# Altium project Mother Board.PrjPcb
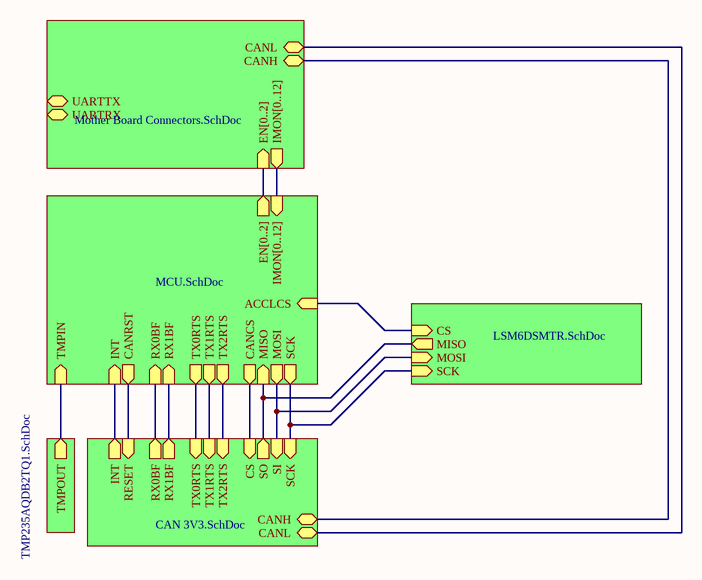
[diagram p0: Mother Board.SchDoc]
3 sheets, 20 parts. Net scope: hierarchical (ports join the sheet entries above them; power ports are global).
Board file: Mother Board.PcbDoc
Sheets:
  Mother Board.SchDoc
    Designator = Mother Board Connectors.SchDoc
    Designator = MCU.SchDoc

## Sheet Mother Board.SchDoc
size A

### Sub-sheets
Designator = Mother Board Connectors.SchDoc: EN[0..2] (in), IMON[0..12] (out), CANH (bidir), CANL (bidir), UARTTX (bidir), UARTRX (bidir)
Designator = CAN 3V3.SchDoc (file not in this document): SI (in), SO (out), CANH (bidir), TX1RTS (in), RX0BF (out), INT (out), TX2RTS (in), CS (in), SCK (in), RESET (in), TX0RTS (in), CANL (bidir), RX1BF (out)
Designator = TMP235AQDB2TQ1.SchDoc (file not in this document): TMPOUT (out)
Designator = MCU.SchDoc: EN[0..2] (out), IMON[0..12] (in), MISO (in), INT (in), RX0BF (in), RX1BF (in), MOSI (out), TX2RTS (out), TX1RTS (out), TX0RTS (out), TMPIN (in), CANCS (out), SCK (out), CANRST (out), ACCLCS (in)
Designator = LSM6DSMTR.SchDoc (file not in this document): CS (in), MOSI (in), MISO (out), SCK (in)

### Nets
20: sheet Designator/CANL, sheet Designator/CANL
21: sheet Designator/CANH, sheet Designator/CANH
NetU7_1: sheet Designator/RX0BF, sheet Designator/RX0BF
NetU7_2: sheet Designator/INT, sheet Designator/INT
NetU7_3: sheet Designator/RESET, sheet Designator/CANRST
NetU7_5: sheet Designator/SI, sheet Designator/MOSI, sheet Designator/MOSI
NetU7_8: sheet Designator/CS, sheet Designator/CANCS
NetU7_9: sheet Designator/SCK, sheet Designator/SCK, sheet Designator/SCK
NetU7_10: sheet Designator/SO, sheet Designator/MISO, sheet Designator/MISO
NetU7_17: sheet Designator/TMPOUT, sheet Designator/TMPIN
NetU7_36: sheet Designator/TX0RTS, sheet Designator/TX0RTS
NetU7_37: sheet Designator/TX1RTS, sheet Designator/TX1RTS
NetU7_38: sheet Designator/TX2RTS, sheet Designator/TX2RTS
NetU7_39: sheet Designator/ACCLCS, sheet Designator/CS
NetU7_40: sheet Designator/RX1BF, sheet Designator/RX1BF

## Sheet Mother Board Connectors.SchDoc
size B
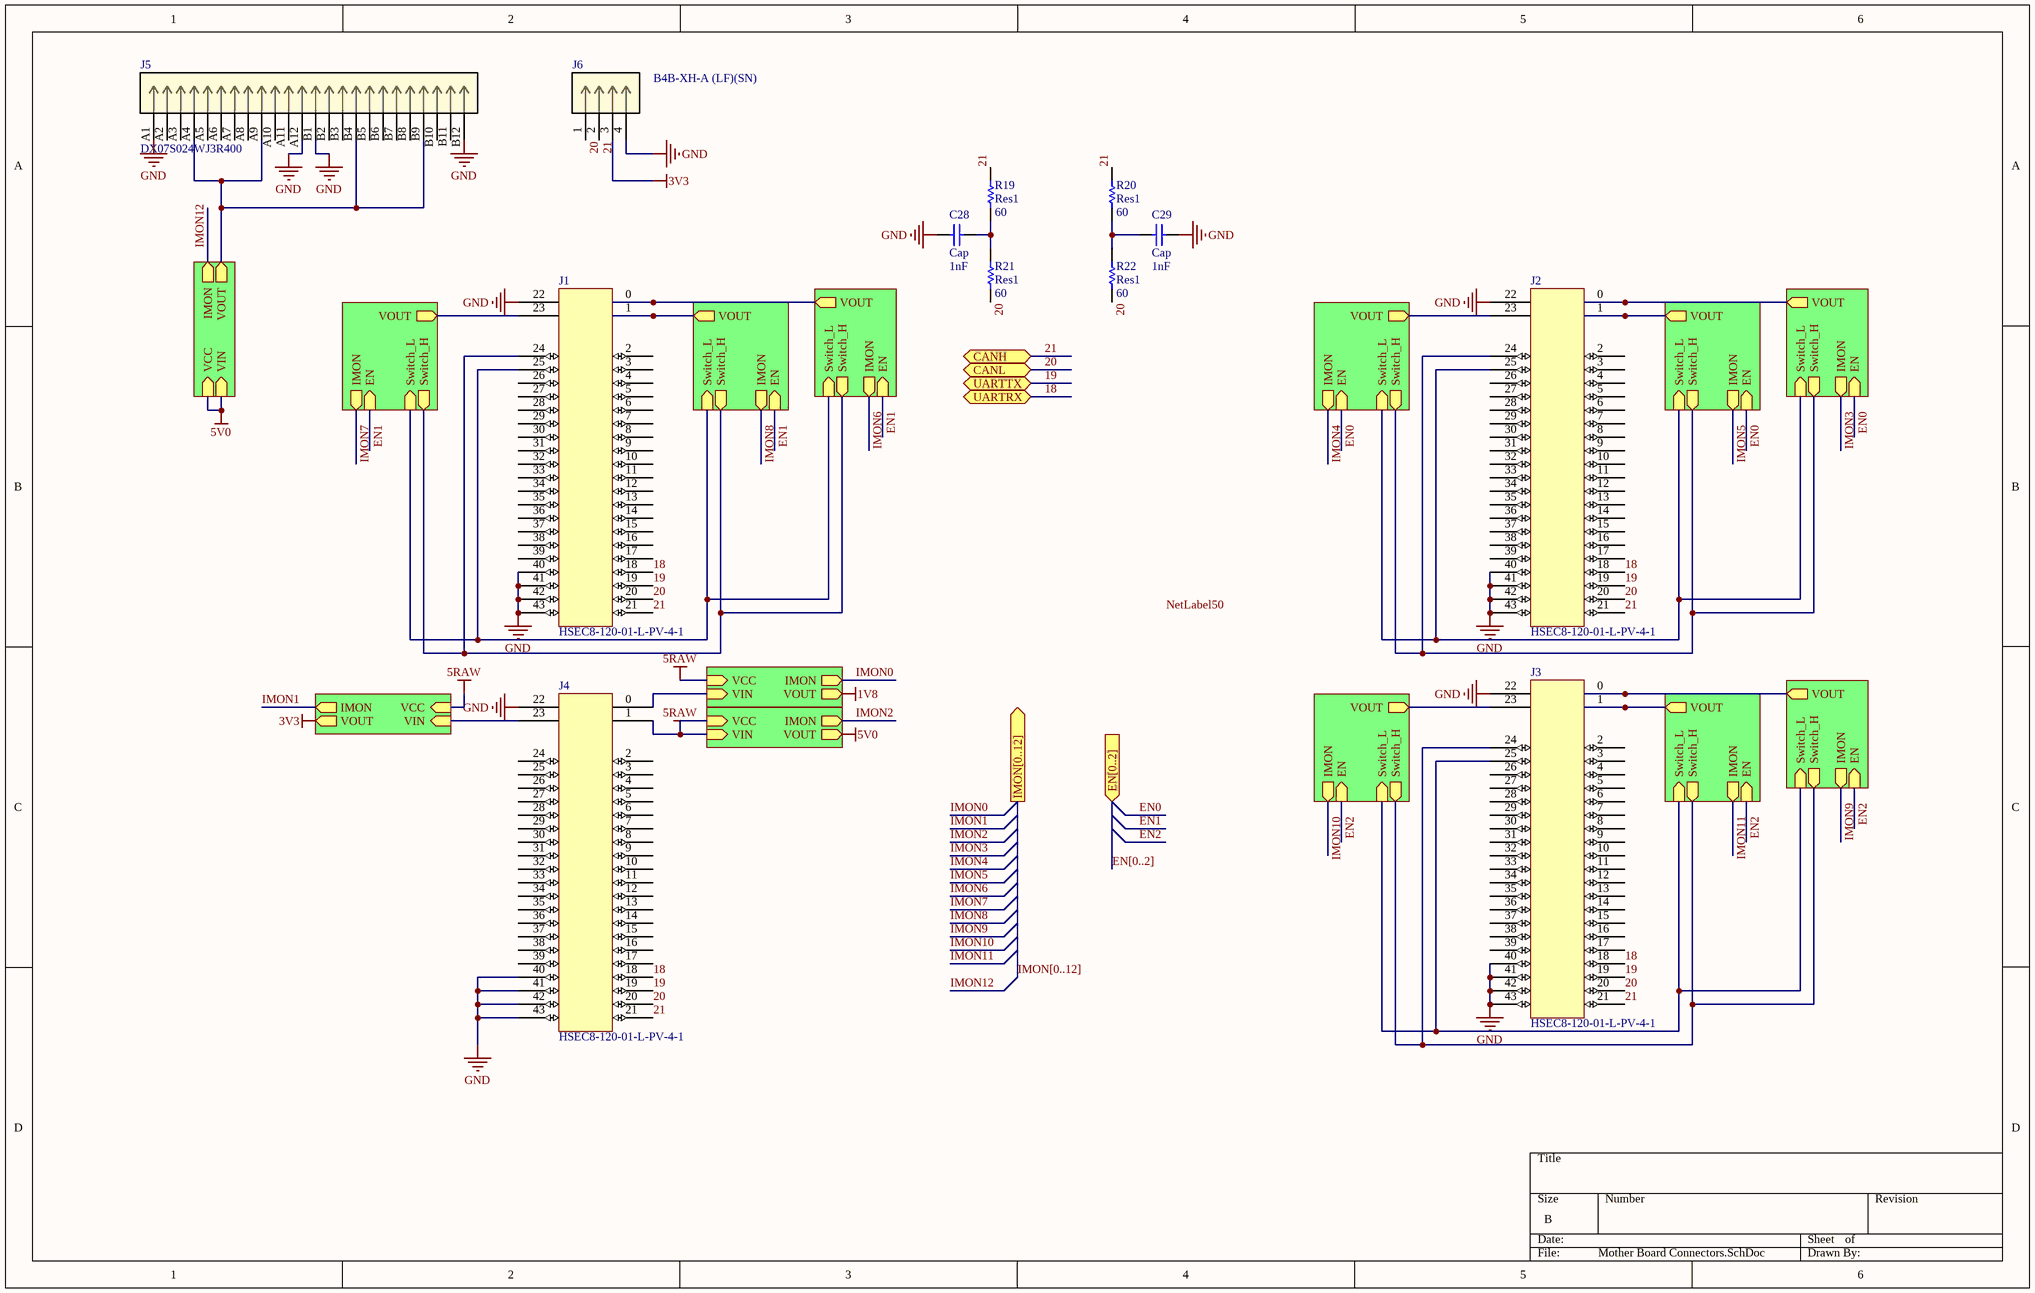
[diagram p1: Mother Board Connectors.SchDoc]

### Parts
C28  Cap  value 1nF  [1608[0603]]
C29  Cap  value 1nF  [1608[0603]]
J1  HSEC8-120-01-L-PV-4-1  [HSEC8-120-01-L-PV-4-1]
J2  HSEC8-120-01-L-PV-4-1  [HSEC8-120-01-L-PV-4-1]
J3  HSEC8-120-01-L-PV-4-1  [HSEC8-120-01-L-PV-4-1]
J4  HSEC8-120-01-L-PV-4-1  [HSEC8-120-01-L-PV-4-1]
J5  DX07S024WJ3R400  [CONN_DX07S024WJ1R350_JAE]
J6  B4B-XH-A (LF)(SN)  [CONN_B4B-XH-A (LF)(SN)_JST]
R19  Res1  value 60  [0402-A]
R20  Res1  value 60  [0402-A]
R21  Res1  value 60  [0402-A]
R22  Res1  value 60  [0402-A]

### Sub-sheets
Designator = Current-LoadSwitches 1V8.SchDoc (file not in this document): EN (in), Switch_L (in), IMON (out), VOUT (out), Switch_H (out)
Designator = Current-LoadSwitches 5V0.SchDoc (file not in this document): EN (in), Switch_L (in), IMON (out), VOUT (out), Switch_H (out)
Designator = Current-LoadSwitches 3V3.SchDoc (file not in this document): EN (in), Switch_L (in), IMON (out), VOUT (out), Switch_H (out)
Designator = Current-LoadSwitches 1V8.SchDoc (file not in this document): EN (in), Switch_L (in), IMON (out), VOUT (out), Switch_H (out)
Designator = Current-LoadSwitches 5V0.SchDoc (file not in this document): EN (in), Switch_L (in), IMON (out), VOUT (out), Switch_H (out)
Designator = Current-LoadSwitches 3V3.SchDoc (file not in this document): EN (in), Switch_L (in), IMON (out), VOUT (out), Switch_H (out)
Designator = Current-LoadSwitches 1V8.SchDoc (file not in this document): EN (in), Switch_L (in), IMON (out), VOUT (out), Switch_H (out)
Designator = Current-LoadSwitches 5V0.SchDoc (file not in this document): EN (in), Switch_L (in), IMON (out), VOUT (out), Switch_H (out)
Designator = Current-LoadSwitches 3V3.SchDoc (file not in this document): EN (in), Switch_L (in), IMON (out), VOUT (out), Switch_H (out)
Designator = Current-LoadSwitches PMS.SchDoc (file not in this document): VIN (in), IMON (out), VOUT (out), VCC (in)
Designator = Current-LoadSwitches PMS.SchDoc (file not in this document): VIN (in), IMON (out), VOUT (out), VCC (in)
Designator = Current-LoadSwitches PMS.SchDoc (file not in this document): VIN (in), IMON (out), VOUT (out), VCC (in)
Designator = Current-LoadSwitches PMS.SchDoc (file not in this document): VIN (in), IMON (out), VOUT (out), VCC (in)

### Ports
CANH (bidir), CANL (bidir), EN[0..2] (in), IMON[0..12] (out), UARTRX (bidir), UARTTX (bidir)

### Nets
1V8: sheet Designator/VOUT
3V3: J6.3 ; sheet Designator/VOUT
5RAW: J4.1 ; sheet Designator/VCC, sheet Designator/VIN, sheet Designator/VCC, sheet Designator/VCC
5V0: sheet Designator/VOUT, sheet Designator/VIN, sheet Designator/VCC
GND: C28.2 C29.1 J1.22 J1.40 J1.41 J1.42 J1.43 J2.22 J2.40 J2.41 J2.42 J2.43 J3.22 J3.40 J3.41 J3.42 J3.43 J4.22 J4.40 J4.41 J4.42 J4.43 J5.A1 J5.A12(B7) J5.B1(A7) J5.B12(B1) J6.4
18: J1.18 J2.18 J3.18 J4.18 ; port UARTRX
19: J1.19 J2.19 J3.19 J4.19 ; port UARTTX
20: J1.20 J2.20 J3.20 J4.20 J6.1 R21.1 R22.1 ; port CANL
21: J1.21 J2.21 J3.21 J4.21 J6.2 R19.2 R20.2 ; port CANH
EN0: sheet Designator/EN, sheet Designator/EN, sheet Designator/EN
EN1: sheet Designator/EN, sheet Designator/EN, sheet Designator/EN
EN2: sheet Designator/EN, sheet Designator/EN, sheet Designator/EN
NetC28_1: C28.1 R19.1 R21.2
NetC29_2: C29.2 R20.1 R22.2
NetJ1_0: J1.0 ; sheet Designator/VOUT
NetJ1_1: J1.1 ; sheet Designator/VOUT
NetJ1_23: J1.23 ; sheet Designator/VOUT
NetJ1_24: J1.24 ; sheet Designator/Switch_H, sheet Designator/Switch_H, sheet Designator/Switch_H
NetJ1_25: J1.25 ; sheet Designator/Switch_L, sheet Designator/Switch_L, sheet Designator/Switch_L
NetJ2_0: J2.0 ; sheet Designator/VOUT
NetJ2_1: J2.1 ; sheet Designator/VOUT
NetJ2_23: J2.23 ; sheet Designator/VOUT
NetJ2_24: J2.24 ; sheet Designator/Switch_H, sheet Designator/Switch_H, sheet Designator/Switch_H
NetJ2_25: J2.25 ; sheet Designator/Switch_L, sheet Designator/Switch_L, sheet Designator/Switch_L
NetJ3_0: J3.0 ; sheet Designator/VOUT
NetJ3_1: J3.1 ; sheet Designator/VOUT
NetJ3_23: J3.23 ; sheet Designator/VOUT
NetJ3_24: J3.24 ; sheet Designator/Switch_H, sheet Designator/Switch_H, sheet Designator/Switch_H
NetJ3_25: J3.25 ; sheet Designator/Switch_L, sheet Designator/Switch_L, sheet Designator/Switch_L
NetJ4_0: J4.0 ; sheet Designator/VIN
NetJ4_23: J4.23 ; sheet Designator/VIN
NetJ5_A4: J5.A4(B11) J5.A9(A5) J5.B4(B5) J5.B9(A11) ; sheet Designator/VOUT

Not connected (* = marked no-connect by the designer): J1 2(0) 3(0) 4(0) 5(0) 6(0) 7(0) 8(0) 9(0) 10(0) 11(0) 12(0) 13(0) 14(0) 15(0) 16(0) 17(0) 26 27 28 29 30 31 32 33 34 35 36 37 38 39; J2 2(0) 3(0) 4(0) 5(0) 6(0) 7(0) 8(0) 9(0) 10(0) 11(0) 12(0) 13(0) 14(0) 15(0) 16(0) 17(0) 26 27 28 29 30 31 32 33 34 35 36 37 38 39; J3 2(0) 3(0) 4(0) 5(0) 6(0) 7(0) 8(0) 9(0) 10(0) 11(0) 12(0) 13(0) 14(0) 15(0) 16(0) 17(0) 26 27 28 29 30 31 32 33 34 35 36 37 38 39; J4 2(0) 3(0) 4(0) 5(0) 6(0) 7(0) 8(0) 9(0) 10(0) 11(0) 12(0) 13(0) 14(0) 15(0) 16(0) 17(0) 24 25 26 27 28 29 30 31 32 33 34 35 36 37 38 39; J5 A2(B12) A3(A2) A5(A3) A6(B10) A7(A4) A8(B9) A10(B8) A11(A6) B2(B6) B3(A8) B5(A9) B6(B4) B7(A10) B8(B3) B10(B2) B11(A12)

### Buses and harness runs
bus EN[0..2] = port EN[0..2]
bus IMON[0..12] = port IMON[0..12]

### Notes on the sheet
- Labels drawn without touching a wire or pin: NetLabel50

### Library data of the parts
C28 C29 = Cap: Capacitor; Published: 8-Jun-2000; LatestRevisionDate: 17-Jul-2002; LatestRevisionNote: Re-released for DXP Platform.; PackageReference: RAD-0.3; Publisher: Altium Limited; PackageDescription: Radial Cap, Thru-Hole; 2 Leads; 0.3 in Pin Spacing
J5 = DX07S024WJ3R400: No Description Available; Vendor: JAE Electronics; Built_By: EMA_TJ; SourceLibrary: JAE_2019-01-31; Copyright: Copyright (C) 2018 Accelerated Designs. All rights reserved; Manufacturer_Part_Number: DX07S024WJ3R400; RefDes: RefDes; Type: DEV
J6 = B4B-XH-A (LF)(SN): No Description Available; Vendor: JST; Built_By: EMA_Cory; SourceLibrary: JST_2020-02-03; Datasheet: http://www.jst-mfg.com/product/pdf/eng/eXH.pdf; Manufacturer_Part_Number: B4B-XH-A (LF)(SN); Copyright: Copyright (C) 2018 Accelerated Designs. All rights reserved; RefDes: RefDes; Type: DEV
R19-R22 = Res1: Resistor; Published: 8-Jun-2000; LatestRevisionDate: 17-Jul-2002; LatestRevisionNote: Re-released for DXP Platform.; PackageReference: AXIAL-0.3; Publisher: Altium Limited; PackageDescription: Axial Device, Thru-Hole; 2 Leads; 0.3 in Pin Spacing
J1-J4 = HSEC8-120-01-L-PV-4-1: Supplier 1: Mouser

## Sheet MCU.SchDoc
size A
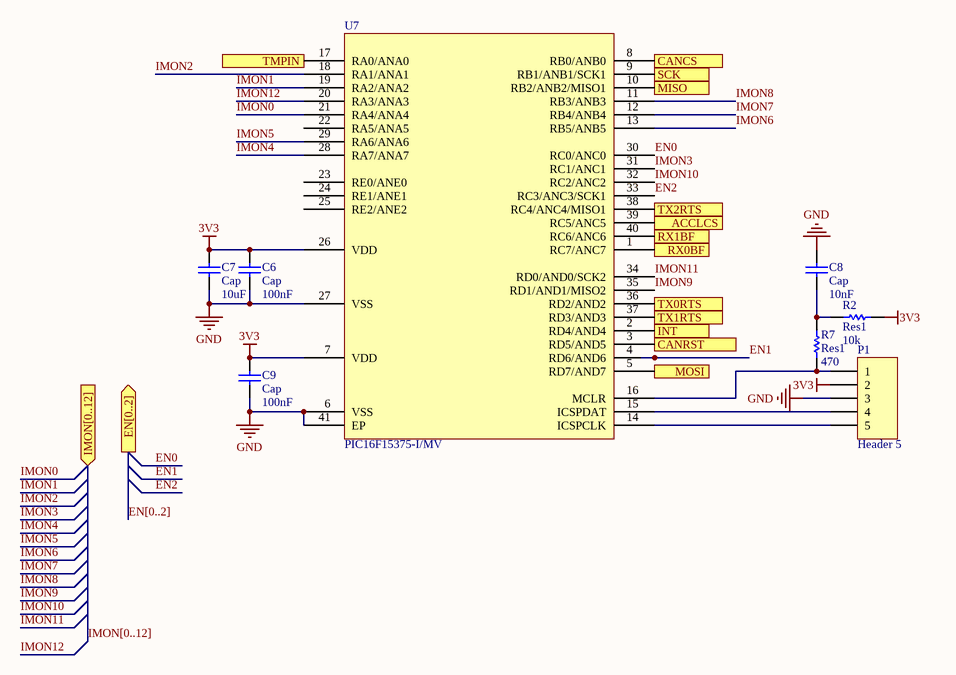
[diagram p2: MCU.SchDoc]

### Parts
C6  Cap  value 100nF  [1608[0603]]
C7  Cap  value 10uF  [6-0805_M]
C8  Cap  value 10nF  [1608[0603]]
C9  Cap  value 100nF  [1608[0603]]
P1  Header 5  [HDR1X5]
R2  Res1  value 10k  [0402-A]
R7  Res1  value 470  [0402-A]
U7  PIC16F15375-I/MV  [PIC16F15375-I/MV]

### Ports
ACCLCS (in), CANCS (out), CANRST (out), EN[0..2] (out), IMON[0..12] (in), INT (in), MISO (in), MOSI (out), RX0BF (in), RX1BF (in), SCK (out), TMPIN (in), TX0RTS (out), TX1RTS (out), TX2RTS (out)

### Nets
3V3: C6.2 C7.2 C9.2 P1.2 R2.2 U7.7(VDD) U7.26(VDD)
GND: C6.1 C7.1 C8.1 C9.1 P1.3 U7.6(VSS) U7.27(VSS) U7.41(EP)
EN0: U7.30(RC0/ANC0)
EN1: U7.4(RD6/AND6)
EN2: U7.33(RC3/ANC3/SCK1)
IMON0: U7.21(RA4/ANA4)
IMON1: U7.19(RA2/ANA2)
IMON2: U7.18(RA1/ANA1)
IMON3: U7.31(RC1/ANC1)
IMON4: U7.28(RA7/ANA7)
IMON5: U7.29(RA6/ANA6)
IMON6: U7.13(RB5/ANB5)
IMON7: U7.12(RB4/ANB4)
IMON8: U7.11(RB3/ANB3)
IMON9: U7.35(RD1/AND1/MISO2)
IMON10: U7.32(RC2/ANC2)
IMON11: U7.34(RD0/AND0/SCK2)
IMON12: U7.20(RA3/ANA3)
NetC8_2: C8.2 R2.1 R7.2
NetP1_1: P1.1 R7.1 U7.16(MCLR)
NetP1_4: P1.4 U7.15(ICSPDAT)
NetP1_5: P1.5 U7.14(ICSPCLK)
NetU7_1: U7.1(RC7/ANC7) ; port RX0BF
NetU7_2: U7.2(RD4/AND4) ; port INT
NetU7_3: U7.3(RD5/AND5) ; port CANRST
NetU7_5: U7.5(RD7/AND7) ; port MOSI
NetU7_8: U7.8(RB0/ANB0) ; port CANCS
NetU7_9: U7.9(RB1/ANB1/SCK1) ; port SCK
NetU7_10: U7.10(RB2/ANB2/MISO1) ; port MISO
NetU7_17: U7.17(RA0/ANA0) ; port TMPIN
NetU7_36: U7.36(RD2/AND2) ; port TX0RTS
NetU7_37: U7.37(RD3/AND3) ; port TX1RTS
NetU7_38: U7.38(RC4/ANC4/MISO1) ; port TX2RTS
NetU7_39: U7.39(RC5/ANC5) ; port ACCLCS
NetU7_40: U7.40(RC6/ANC6) ; port RX1BF

Not connected (* = marked no-connect by the designer): U7 22(RA5/ANA5) 23(RE0/ANE0) 24(RE1/ANE1) 25(RE2/ANE2)

### Buses and harness runs
bus EN[0..2] = port EN[0..2]
bus IMON[0..12] = port IMON[0..12]

### Library data of the parts
C6-C9 = Cap: Capacitor; Published: 8-Jun-2000; LatestRevisionDate: 17-Jul-2002; LatestRevisionNote: Re-released for DXP Platform.; PackageReference: RAD-0.3; Publisher: Altium Limited; PackageDescription: Radial Cap, Thru-Hole; 2 Leads; 0.3 in Pin Spacing
P1 = Header 5: Header, 5-Pin; LatestRevisionDate: 17-Jul-2002; LatestRevisionNote: Re-released for DXP Platform.; Publisher: Altium Limited
R2 R7 = Res1: Resistor; Published: 8-Jun-2000; LatestRevisionDate: 17-Jul-2002; LatestRevisionNote: Re-released for DXP Platform.; PackageReference: AXIAL-0.3; Publisher: Altium Limited; PackageDescription: Axial Device, Thru-Hole; 2 Leads; 0.3 in Pin Spacing

## Nets that join several sheets
3V3: Mother Board Connectors (J6.3), MCU (7 pins)
GND: Mother Board Connectors (27 pins), MCU (8 pins)